# EAGLE design Adafruit Rotary Trinkey (EAGLE 9.6.2)
AUTHOR: ladyada
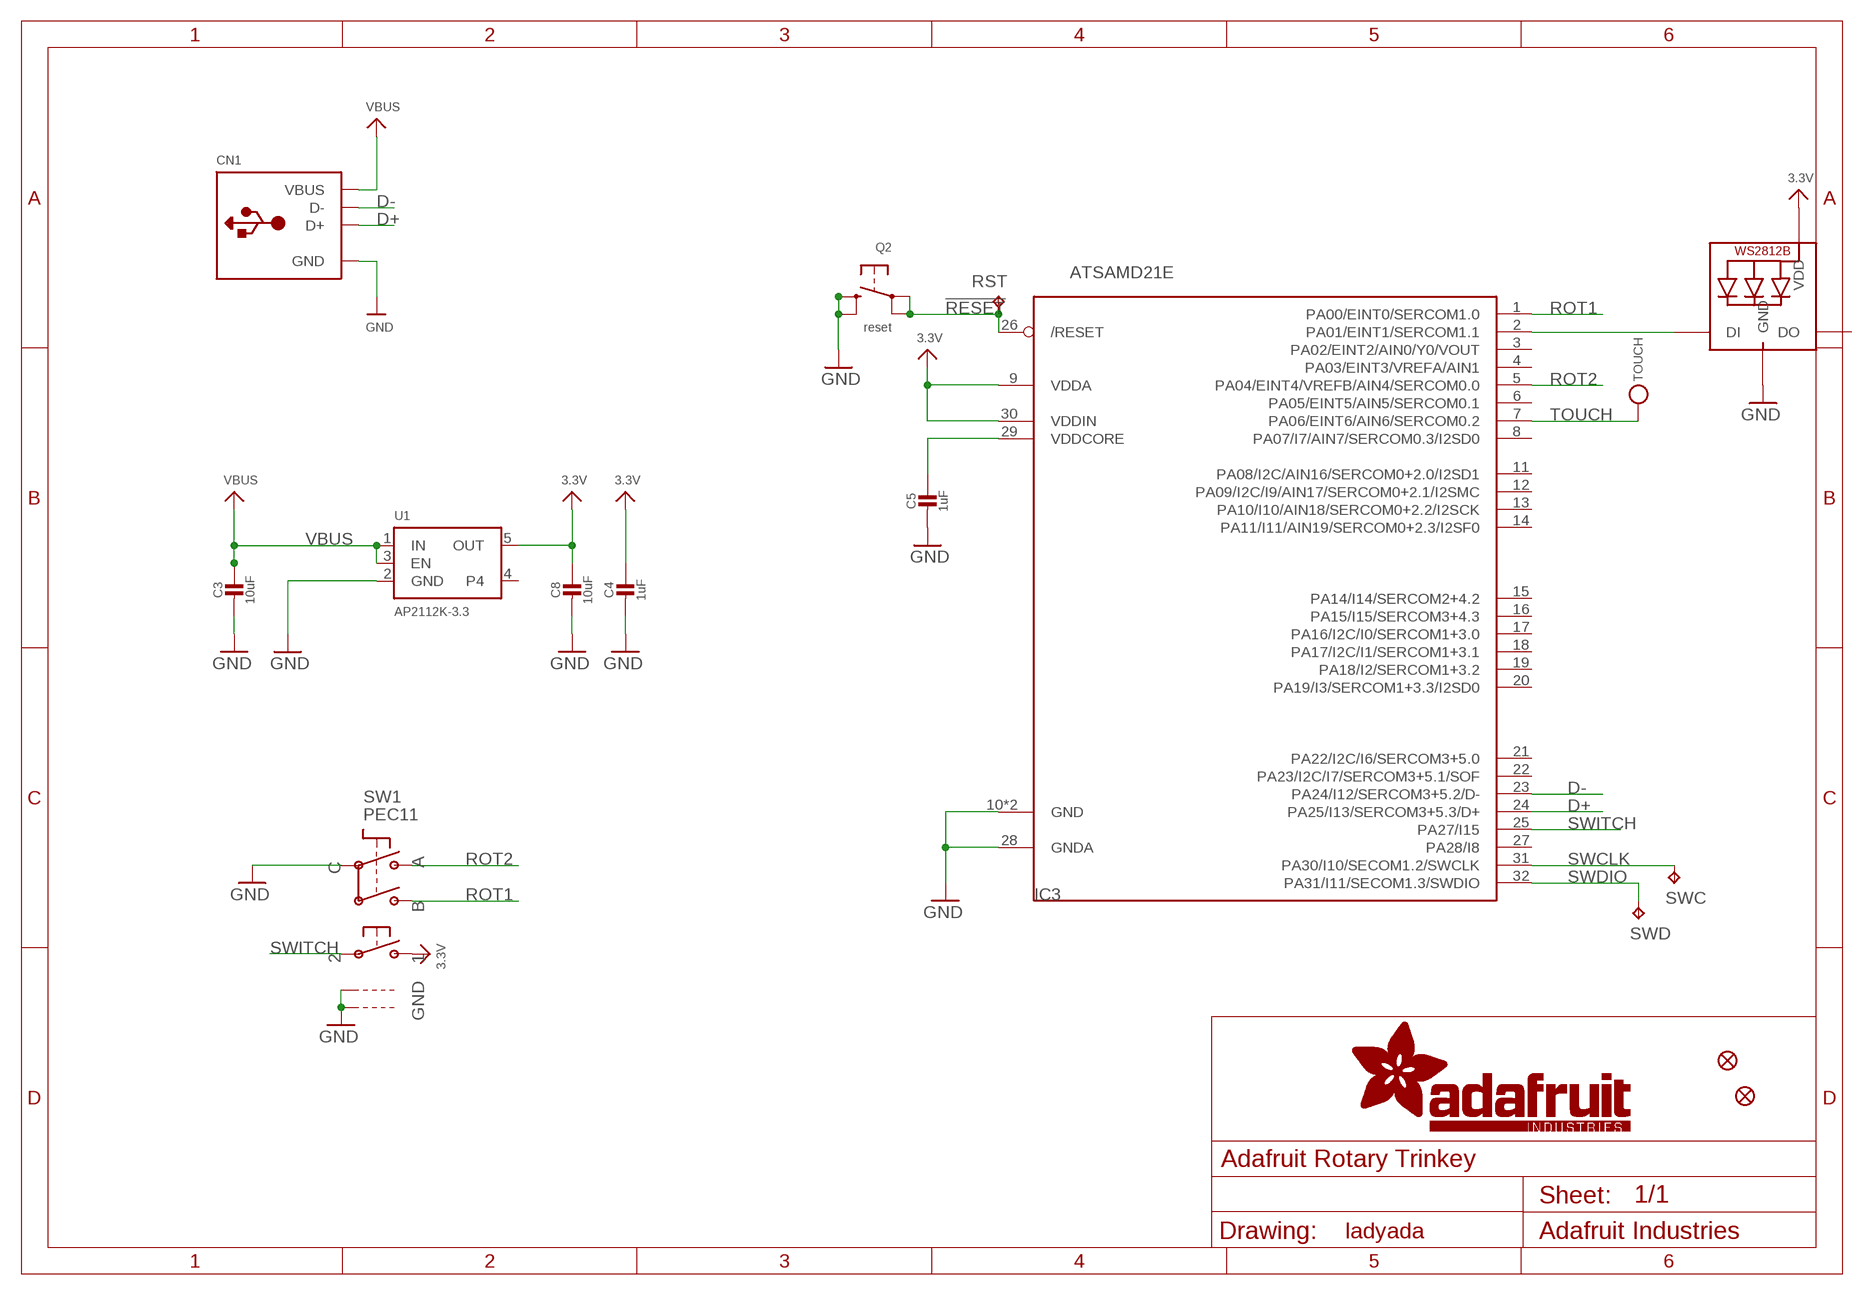
[diagram p0: schematic, sheet 1]

## Parts
C3  10uF  CAP_CERAMIC0805-NOOUTLINE  [0805-NO]
C4  1uF  CAP_CERAMIC0603_NO  [0603-NO]
C5  1uF  CAP_CERAMIC0603_NO  [0603-NO]
C8  10uF  CAP_CERAMIC0805-NOOUTLINE  [0805-NO]
CN1  USB_TYPEAPCB  [USBA_PCB]
FID1  FIDUCIAL_1MM  [FIDUCIAL_1MM]
FID2  FIDUCIAL_1MM  [FIDUCIAL_1MM]
IC3  ATSAMD21E  [QFN32_5MM]
LED1  WS2812B_SK6805_1515  [SK6805_1515]
Q2  reset  SWITCH_TACT_SMT4.6X2.8  [BTN_KMR2_4.6X2.8]
RST  TPTP16R  [TP16R]
SW1  PEC11  ENCODER_PLUS_SWITCH_BOURNS_PEC11  [PEC11+SWITCH]
SWC  TPTP16R  [TP16R]
SWD  TPTP16R  [TP16R]
TOUCH  TESTPOINTPAD1MM  [TESTPOINT_PAD_1MM]
U1  AP2112K-3.3  VREG_SOT23-5  [SOT23-5]

## Nets
3.3V: C4.1 C8.1 IC3.9(VDDA) IC3.30(VDDIN) LED1.2(VDD) SW1.P$1 U1.5(OUT)
!RESET: IC3.26(/RESET) Q2.A'(P1) Q2.A(P) RST.TP
D+: CN1.USB_PLUS(D+) IC3.24(PA25/I13/SERCOM3+5.3/D+)
D-: CN1.USB_NEG(D-) IC3.23(PA24/I12/SERCOM3+5.2/D-)
GND: C3.2 C4.2 C5.2 C8.2 CN1.GND IC3.10(GND) IC3.28(GNDA) IC3.33(GND) LED1.4(GND) Q2.B'(S1) Q2.B(S) SW1.P$C SW1.P$GND1 SW1.P$GND2 U1.2(GND)
N$1: IC3.2(PA01/EINT1/SERCOM1.1) LED1.1(DI)
ROT1: IC3.1(PA00/EINT0/SERCOM1.0) SW1.P$B
ROT2: IC3.5(PA04/EINT4/VREFB/AIN4/SERCOM0.0) SW1.P$A
SWCLK: IC3.31(PA30/I10/SECOM1.2/SWCLK) SWC.TP
SWDIO: IC3.32(PA31/I11/SECOM1.3/SWDIO) SWD.TP
SWITCH: IC3.25(PA27/I15) SW1.P$2
TOUCH: IC3.7(PA06/EINT6/AIN6/SERCOM0.2) TOUCH.P$1
VBUS: C3.1 CN1.VCC(VBUS) U1.1(IN) U1.3(EN)
VDDCORE1: C5.1 IC3.29(VDDCORE)
Unconnected: IC3.3(PA02/EINT2/AIN0/Y0/VOUT) IC3.4(PA03/EINT3/VREFA/AIN1) IC3.6(PA05/EINT5/AIN5/SERCOM0.1) IC3.8(PA07/I7/AIN7/SERCOM0.3/I2SD0) IC3.11(PA08/I2C/AIN16/SERCOM0+2.0/I2SD1) IC3.12(PA09/I2C/I9/AIN17/SERCOM0+2.1/I2SMC) IC3.13(PA10/I10/AIN18/SERCOM0+2.2/I2SCK) IC3.14(PA11/I11/AIN19/SERCOM0+2.3/I2SF0) IC3.15(PA14/I14/SERCOM2+4.2) IC3.16(PA15/I15/SERCOM3+4.3) IC3.17(PA16/I2C/I0/SERCOM1+3.0) IC3.18(PA17/I2C/I1/SERCOM1+3.1) IC3.19(PA18/I2/SERCOM1+3.2) IC3.20(PA19/I3/SERCOM1+3.3/I2SD0) IC3.21(PA22/I2C/I6/SERCOM3+5.0) IC3.22(PA23/I2C/I7/SERCOM3+5.1/SOF) IC3.27(PA28/I8) LED1.3(DO) U1.4

## Library data of the parts
C3-C5 C8 = microbuilder:CAP_CERAMIC: Ceramic Capacitors For new designs, use the packages preceded by an '_' character since they are more reliable: The following footprints should be used on most boards: _0402 - Standard footprint for regular board layouts _0603 - Standard footprint for regular board layouts _0805 - Standard footprint for regular board layouts _1206 - Standard footprint for regular board layouts For extremely tight-pitch boards where space is at a premium, the following 'micro-pitch' footprints can be used (smaller pads, no silkscreen outline, etc.): _0402MP - Micro-pitch footprint for very dense/compact boards _0603MP - Micro-pitch footprint for very dense/compact boards _0805MP - Micro-pitch footprint for very dense/compact boards _1206MP - Micro-pitch footprint for very dense/compact boards
CN1 = microbuilder:USB_TYPEA: USB - Type A Connectors Male types stick out and are inserted into a PC or matching females parts (these are the connectors used on USB Memory Sticks, etc.). Female parts are generally used for USB Host and accept a male-type connector. SMT - 4UCON: 10017 PTHFML - Digikey: 609-1045-ND, 4UCon: 05241 PCB - Use 2.0mm thick PCBs with this footprint
FID1 FID2 = microbuilder:FIDUCIAL: Fiducial Alignment Points Various fiducial points for machine vision alignment.; BOM: EXCLUDE
IC3 = microbuilder:ATSAMD21E
LED1 = microbuilder:WS2812B
Q2 = microbuilder:SWITCH_TACT_SMT: SMT Tact Switches 6x6mm - Digikey: P12940SCT-ND KMR2 (4.6x2.8mm) - Digikey: 401-1426-1-ND EVQ-PQHB55 - Light Touch, 160GF (4.5x4.5mm) - Digikey: P8090SCT-ND KMT0 - KMT021 NGJ LHS (etc.) IP68/Waterproof - Digikey: CKN10289CT-ND
RST SWC SWD = testpad:TP: Test pad
SW1 = adafruit_electromech:ENCODER_PLUS_SWITCH: Rotary Encoder with Built-In Switch PEC11 - 24 Step, PEC11-4215F-S24 - http://www.adafruit.com/products/377
TOUCH = microbuilder:TESTPOINT: Test Point Various test points for characterisation and PCB testing TESTPOINT_SMT - Compact Surface Mount Test Point [Digikey: 5016KTR-ND]
U1 = microbuilder:VREG_SOT23-5: SOT23-5 Fixed Voltage Regulators Part Current Out V Out V In V Dropout θJA (°C/W) TJ (°C) Digikey Part No. ADP121 150mA 3.3V 3.4-5.5V 0.09V @ 150mA -- -- ADP121-AUJZ33R7CT-ND ADP121 150mA 3.0V 3.1-5.5V 0.09V @ 150mA -- -- ADP121-AUJZ30R7CT-ND ADP122 300mA 3.3V 3.4-5.5V 0.085V @ 300mA -- -- ADP122AUJZ-3.3-R7CT-ND ADP1712 300mA 3.3V 3.5-5.5V 0.17V @ 300mA -- -- ADP1712AUJZ-3.3-R7TR-ND AP7311 (Low Cost) 150mA 3.3V 3.5-6V 0.15V @ 150mA -- -- AP7311-33WG-7DICT-ND LD39015M18R 150mA 1.8V 1.9V-5.5V 0.08V @ 100mA -- -- 497-6977-1-ND LP2985A-33DBVR 150mA 3.3V 3.3-16V 0.28V @ 150mA 206 150 296-18479-1-ND MCP1824T-3302E/OT 300mA 3.3V 3.5V-6V 0.2V @ 300mA -- -- MCP1824T-3302E/OTCT-ND MIC5205-2.5YM5 TR 150mA 2.5V 2.7-16V 0.165V @ 150mA -- -- 576-1257-2-ND MIC5205-3.0YM5 TR 150mA 3.0V 3.2V-16V 0.165V @ 150mA -- -- 576-1258-2-ND MIC5205-3.3YM5 TR 150mA 3.3V 3.5V-16V 0.165V @ 150mA -- -- 576-1259-2-ND TPS780330220 150mA 3.3V+2.2V 3.6-5.5V 250mV Max -- -- 296-23332-1-ND TDA3663/N1,135 100mA 3.3V 3.5-45V 0.18V @ 50mA -- -- 568-5343-1-ND Max operating temp can be calculated using θJA, TJ (max junction temperature), and power in watts. Set the "Maximum Ambient Temperature" until it reaches TJ ("Max Junction Temperature"), which is the absolute limit for safe use of the regulator: Heat Sink Temperature Calculator <http://www.daycounter.com/Calculators/Heat-Sink-Temperature-Calculator.phtml> For example, With 12V source into a 3.3V LP2985 and a 30mA load, we are dissipating (12V-3.3V) * 0.03A = 0.261W. With a θJA of 206 °C/W, a TJ of 150°C, and 261mW we can safely use the chip without a heat sink up to 75°C (=147.1°C Junction Temperature).

## Board
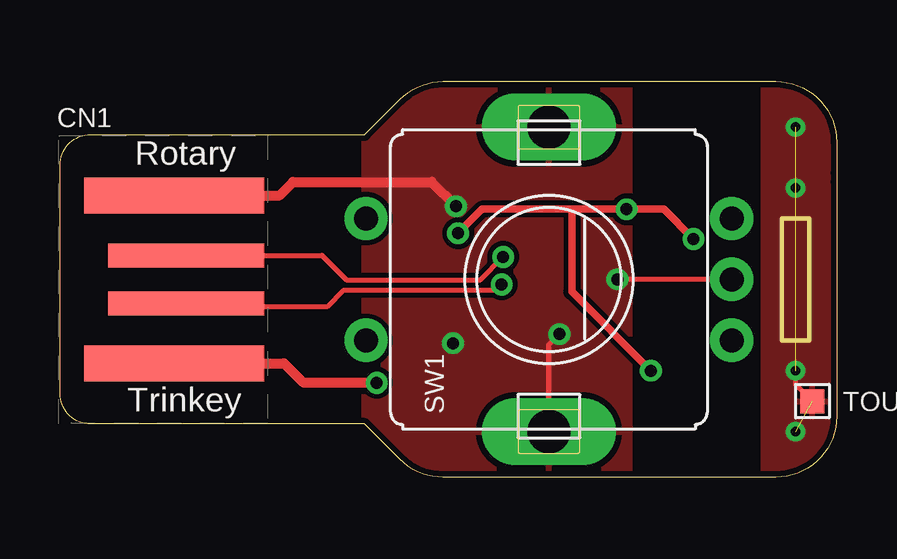
[diagram p1: board, top side]
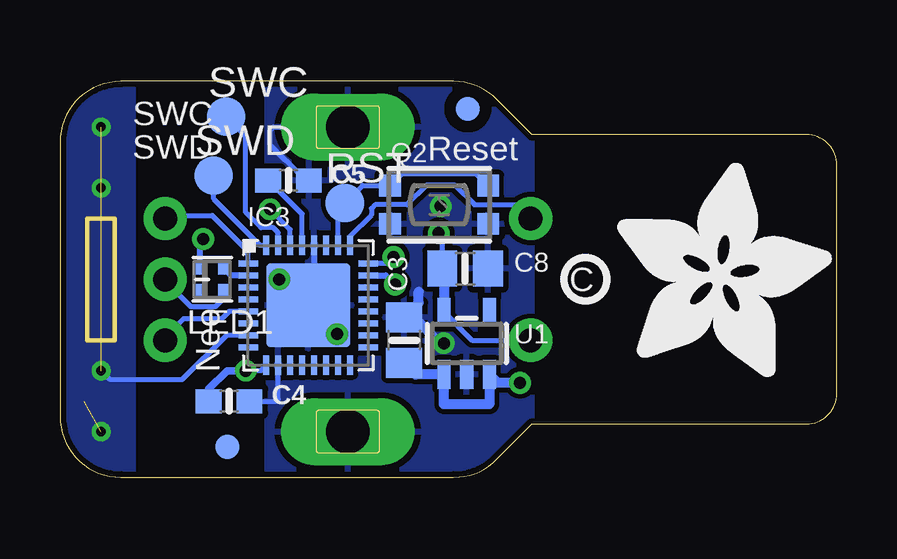
[diagram p2: board, bottom side, seen from below]

Size 32.38 x 16.51 mm. Coordinates in mm from the lower left corner, seen from the top.
Outline: 27.3,16.51 15.97,16.51 arc45 14.18,15.77 12.7,14.29 1.27,14.29 arc90 0,13.02 0,3.49 arc90 1.27,2.22 12.7,2.22 14.18,0.74 arc45 15.97,0 27.43,0
Outline: 27.24,16.51 29.84,16.51 arc-90 32.38,13.97 32.38,12.32
Outline: 32.38,12.7 32.38,2.54 arc-90 29.84,0 27.24,0
Copper layers (1*16): Top 0.035mm / dielectric 1.5mm / Bottom 0.035mm
Design rules "adafruit 8-8 *": minimum track width 8mil, minimum drill 15.5mil, track to track 8mil, track to pad 8mil, pad to pad 8mil, via to via 8mil, smd to smd 8mil, copper to edge 10mil, drill to drill 8mil, minimum pad ring 10mil, minimum via ring 8mil, stop-mask expansion 2mil, vias tented up to drill 20mil, thermal gap 10mil
Milling: 4 lines

### Footprints (pad centres in the part's own frame; a part is rotated, then mirrored left to right if it is on the bottom)
0805-NO = smd 1.24 x 1.5: 1 -0.95,0; 2 0.95,0
0603-NO = smd 1.075 x 1: 1 -0.85,0; 2 0.85,0
USBA_PCB = smd 7.5 x 1.5: GND -0.2,3.5; VCC -0.2,-3.5 | smd 6.5 x 1: USB_NEG 0.3,-1; USB_PLUS 0.3,1
FIDUCIAL_1MM = smd 1 x 1: 1 0,0
QFN32_5MM = smd 0.8 x 0.25: 1 -2.5,1.75; 2 -2.5,1.25; 3 -2.5,0.75; 4 -2.5,0.25; 5 -2.5,-0.25; 6 -2.5,-0.75; 7 -2.5,-1.25; 8 -2.5,-1.75; 17 2.5,-1.75; 18 2.5,-1.25; 19 2.5,-0.75; 20 2.5,-0.25; 21 2.5,0.25; 22 2.5,0.75; 23 2.5,1.25; 24 2.5,1.75 | smd 0.25 x 0.8: 9 -1.75,-2.5; 10 -1.25,-2.5; 11 -0.75,-2.5; 12 -0.25,-2.5; 13 0.25,-2.5; 14 0.75,-2.5; 15 1.25,-2.5; 16 1.75,-2.5; 25 1.75,2.5; 26 1.25,2.5; 27 0.75,2.5; 28 0.25,2.5; 29 -0.25,2.5; 30 -0.75,2.5; 31 -1.25,2.5; 32 -1.75,2.5 | smd 3.5 x 3.5: 33 0,0
SK6805_1515 = smd 0.5 x 0.5: 1 -0.5,-0.45; 2 0.5,-0.45; 3 0.5,0.45; 4 -0.5,0.45
BTN_KMR2_4.6X2.8 = smd 0.9 x 0.9: A 2.05,0.8; A' -2.05,0.8; B 2.05,-0.8; B' -2.05,-0.8
TP16R = smd 1.6 x 1.6: TP 0,0
PEC11+SWITCH = drill 1 pad 1.8: P$1 -2.54,7.62; P$2 2.54,7.62; P$A -2.54,-7.62; P$B 2.54,-7.62; P$C 0,-7.62 | drill 1.8 pad 2.8 long: P$GND1 -6.35,0; P$GND2 6.35,0
TESTPOINT_PAD_1MM = smd 1 x 1: P$1 0,0
SOT23-5 = smd 0.55 x 1.2: 1 -0.95,-1.3; 2 0,-1.3; 3 0.95,-1.3; 4 0.95,1.3; 5 -0.95,1.3

### Placement (x,y rotation side)
C3  18.03,5.72 90 bottom
C4  25.34,3.18 0 bottom
C5  22.86,12.38 0 bottom
C8  15.49,8.7 0 bottom
CN1  4.95,8.26 0 top
FID1  25.4,1.27 0 bottom
FID2  15.38,15.37 0 bottom
IC3  22.03,7.18 0 bottom
LED1  26.04,8.26 180 bottom
Q2  16.57,11.37 0 bottom
RST  20.51,11.43 0 bottom
SW1  20.38,8.26 90 top
SWC  25.46,15.05 0 bottom
SWD  25.97,12.57 0 bottom
TOUCH  31.37,3.18 0 top
U1  15.43,5.59 0 bottom
U$5  [ADAFRUIT_9MM]  9.14,4.19 0 bottom
U$8  [PCBFEAT-REV-040]  10.48,8.26 180 bottom

### Tracks (layer width: path | path; a pad name or v marks a point on that pad's centre or on a via)
3.3V  (via drill 0.5)
  Top 0.305: 21.34,11.18 v23.62,11.18 25.18,11.18 v26.42,9.94 | 21.34,11.18 17.6,11.18 v16.6,10.18 | v24.64,4.45 21.34,7.75 21.34,11.18
  Bottom 0.203: IC3.9 24.02,4.45 v24.64,4.45 | IC3.30 22.79,10.34 v23.62,11.18 | v16.6,10.18 16.44,10.02 C8.1 | U1.5 15.21,5.72 SW1.P$1
  Bottom 0.254: LED1.2 26.54,9.82 v26.42,9.94
  Bottom 0.305: v24.64,4.45 25.42,4.45 26.19,3.68 C4.1
  Bottom 0.406: C8.1 16.38,8.64 U1.5
!RESET
  Bottom 0.203: IC3.26 20.79,10.71 20.51,10.99 RST.TP 19.77,12.17 Q2.A' 18.12,12.68 15.03,12.68 Q2.A
D+  (via drill 0.5)
  Top 0.203: CN1.USB_PLUS 10.92,9.26 11.94,8.24 17.53,8.24 v18.48,9.19
  Bottom 0.203: v18.48,9.19 18.74,8.93 IC3.24
D-  (via drill 0.5)
  Top 0.203: v18.41,8.04 18.16,7.79 11.81,7.79 11.13,7.11 5.4,7.11 CN1.USB_NEG
  Bottom 0.203: 18.8,8.43 v18.41,8.04
  Bottom 0.254: IC3.23 18.8,8.43
GND  (via drill 0.5)
  Top 0.203: SW1.P$GND1 20.38,5.52 v20.83,5.97 | SW1.P$C v23.24,8.26
  Top 0.406: CN1.GND 9.15,11.76 9.72,12.32 15.49,12.32 v16.51,11.3
  Bottom 0.203: v20.83,5.97 IC3.33 22.16,7.18 v23.24,8.26 | LED1.4 25.54,7.49 25.91,7.11 26.92,7.11 28,8.19 SW1.P$C | C4.2 23.37,3.18 23.29,3.26 IC3.10 | C5.2 22.14,12.38 22.96,13.21 22.99,13.21 23.62,13.84 23.62,14.48 23.5,14.61 SW1.P$GND2
  Bottom 0.254: IC3.28 21.79,7.43 IC3.33
  Bottom 0.406: v16.38,5.59 16.53,5.59 17.61,6.67 C3.2 17.43,7.27 17.43,7.74
  pour Top: 12.7,16.51 23.75,16.51 23.75,0 12.7,0
  pour Bottom: 12.7,16.51 23.75,16.51 23.75,0 12.7,0
N$1
  Bottom 0.254: IC3.2 25.26,8.43 LED1.1
ROT1
  Bottom 0.203: 28,10.92 26.04,10.92 24.54,9.42 IC3.1
  Bottom 0.254: SW1.P$B 28,10.92
ROT2
  Bottom 0.203: IC3.5 25.33,6.93 25.65,6.6 27.24,6.6 28.05,5.8
  Bottom 0.254: 28.05,5.8 28,5.76 SW1.P$A
SWCLK
  Bottom 0.203: IC3.31 23.29,10.2 23.5,10.41 24,10.41 24.64,11.05 24.64,14.22 SWC.TP
SWDIO
  Bottom 0.203: IC3.32 24.04,9.68 25.97,11.61 SWD.TP
SWITCH
  Bottom 0.203: SW1.P$2 13.34,11.37 15.11,11.37 15.94,12.19 17.08,12.19 17.91,11.37 19.24,11.37 19.39,11.21 19.39,10.95 20.29,10.06 IC3.25
TOUCH  (via drill 0.39)  (3 unrouted)
  Top 0.203: TOUCH.P$1 30.67,3.87 v30.67,4.45
  Bottom 0.203: IC3.7 25.44,5.93 27.3,4.06 30.29,4.06 v30.67,4.45
  other vias: 30.67,12.07 30.67,14.61 30.67,1.91
  pour Top: 29.34,16.57 32.45,16.57 32.45,0 29.34,0
  pour Bottom: 29.34,16.57 32.45,16.57 32.45,0 29.34,0
VBUS  (via drill 0.5)
  Top 0.406: CN1.VCC 9.34,4.76 10.16,3.94 v13.21,3.94
  Bottom 0.406: v13.21,3.94 14.13,3.94 U1.3 14.48,3.05 16.38,3.05 U1.1 17.56,4.29 C3.1
VDDCORE1
  Bottom 0.203: IC3.29 22.29,10.98 23.69,12.38 C5.1

### Text on the board
tPlace: Rotary | Trinkey
bPlace: SWC | SWD | Reset | Neo
tValues: C1898